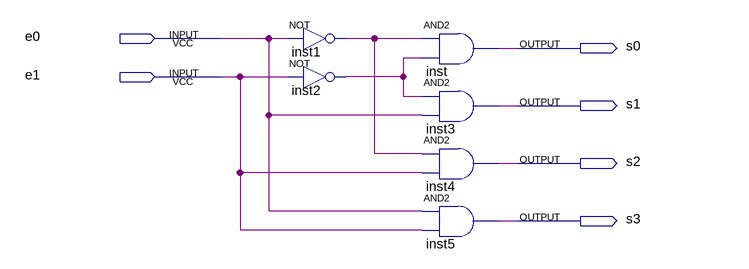
[diagram p0: schematic sheet]
// Quartus schematic Decod2x4.bdf as structural Verilog: 6 symbols, 6 pins
module Decod2x4 (
  input  e0,
  input  e1,
  output s0,
  output s1,
  output s2,
  output s3
);

  wire inst1_out, inst2_out;

  not inst1 (inst1_out, e0);
  not inst2 (inst2_out, e1);
  and inst (s0, inst1_out, inst2_out);
  and inst3 (s1, inst2_out, e0);
  and inst4 (s2, inst1_out, e1);
  and inst5 (s3, e0, e1);
endmodule
